# EasyEDA Pro project 电机控制板_v2.1.epro, schematic schematic11

## Sheets
1 MCU: Create Date: 2024-05-30; Page Name: MCU; Project Name: underwaterJointControlBoard_0430; Schematic Name: schematic11; Update Date: 2024-05-30; Company: 嘉立创EDA; Page Size: A4; Version: V1.0
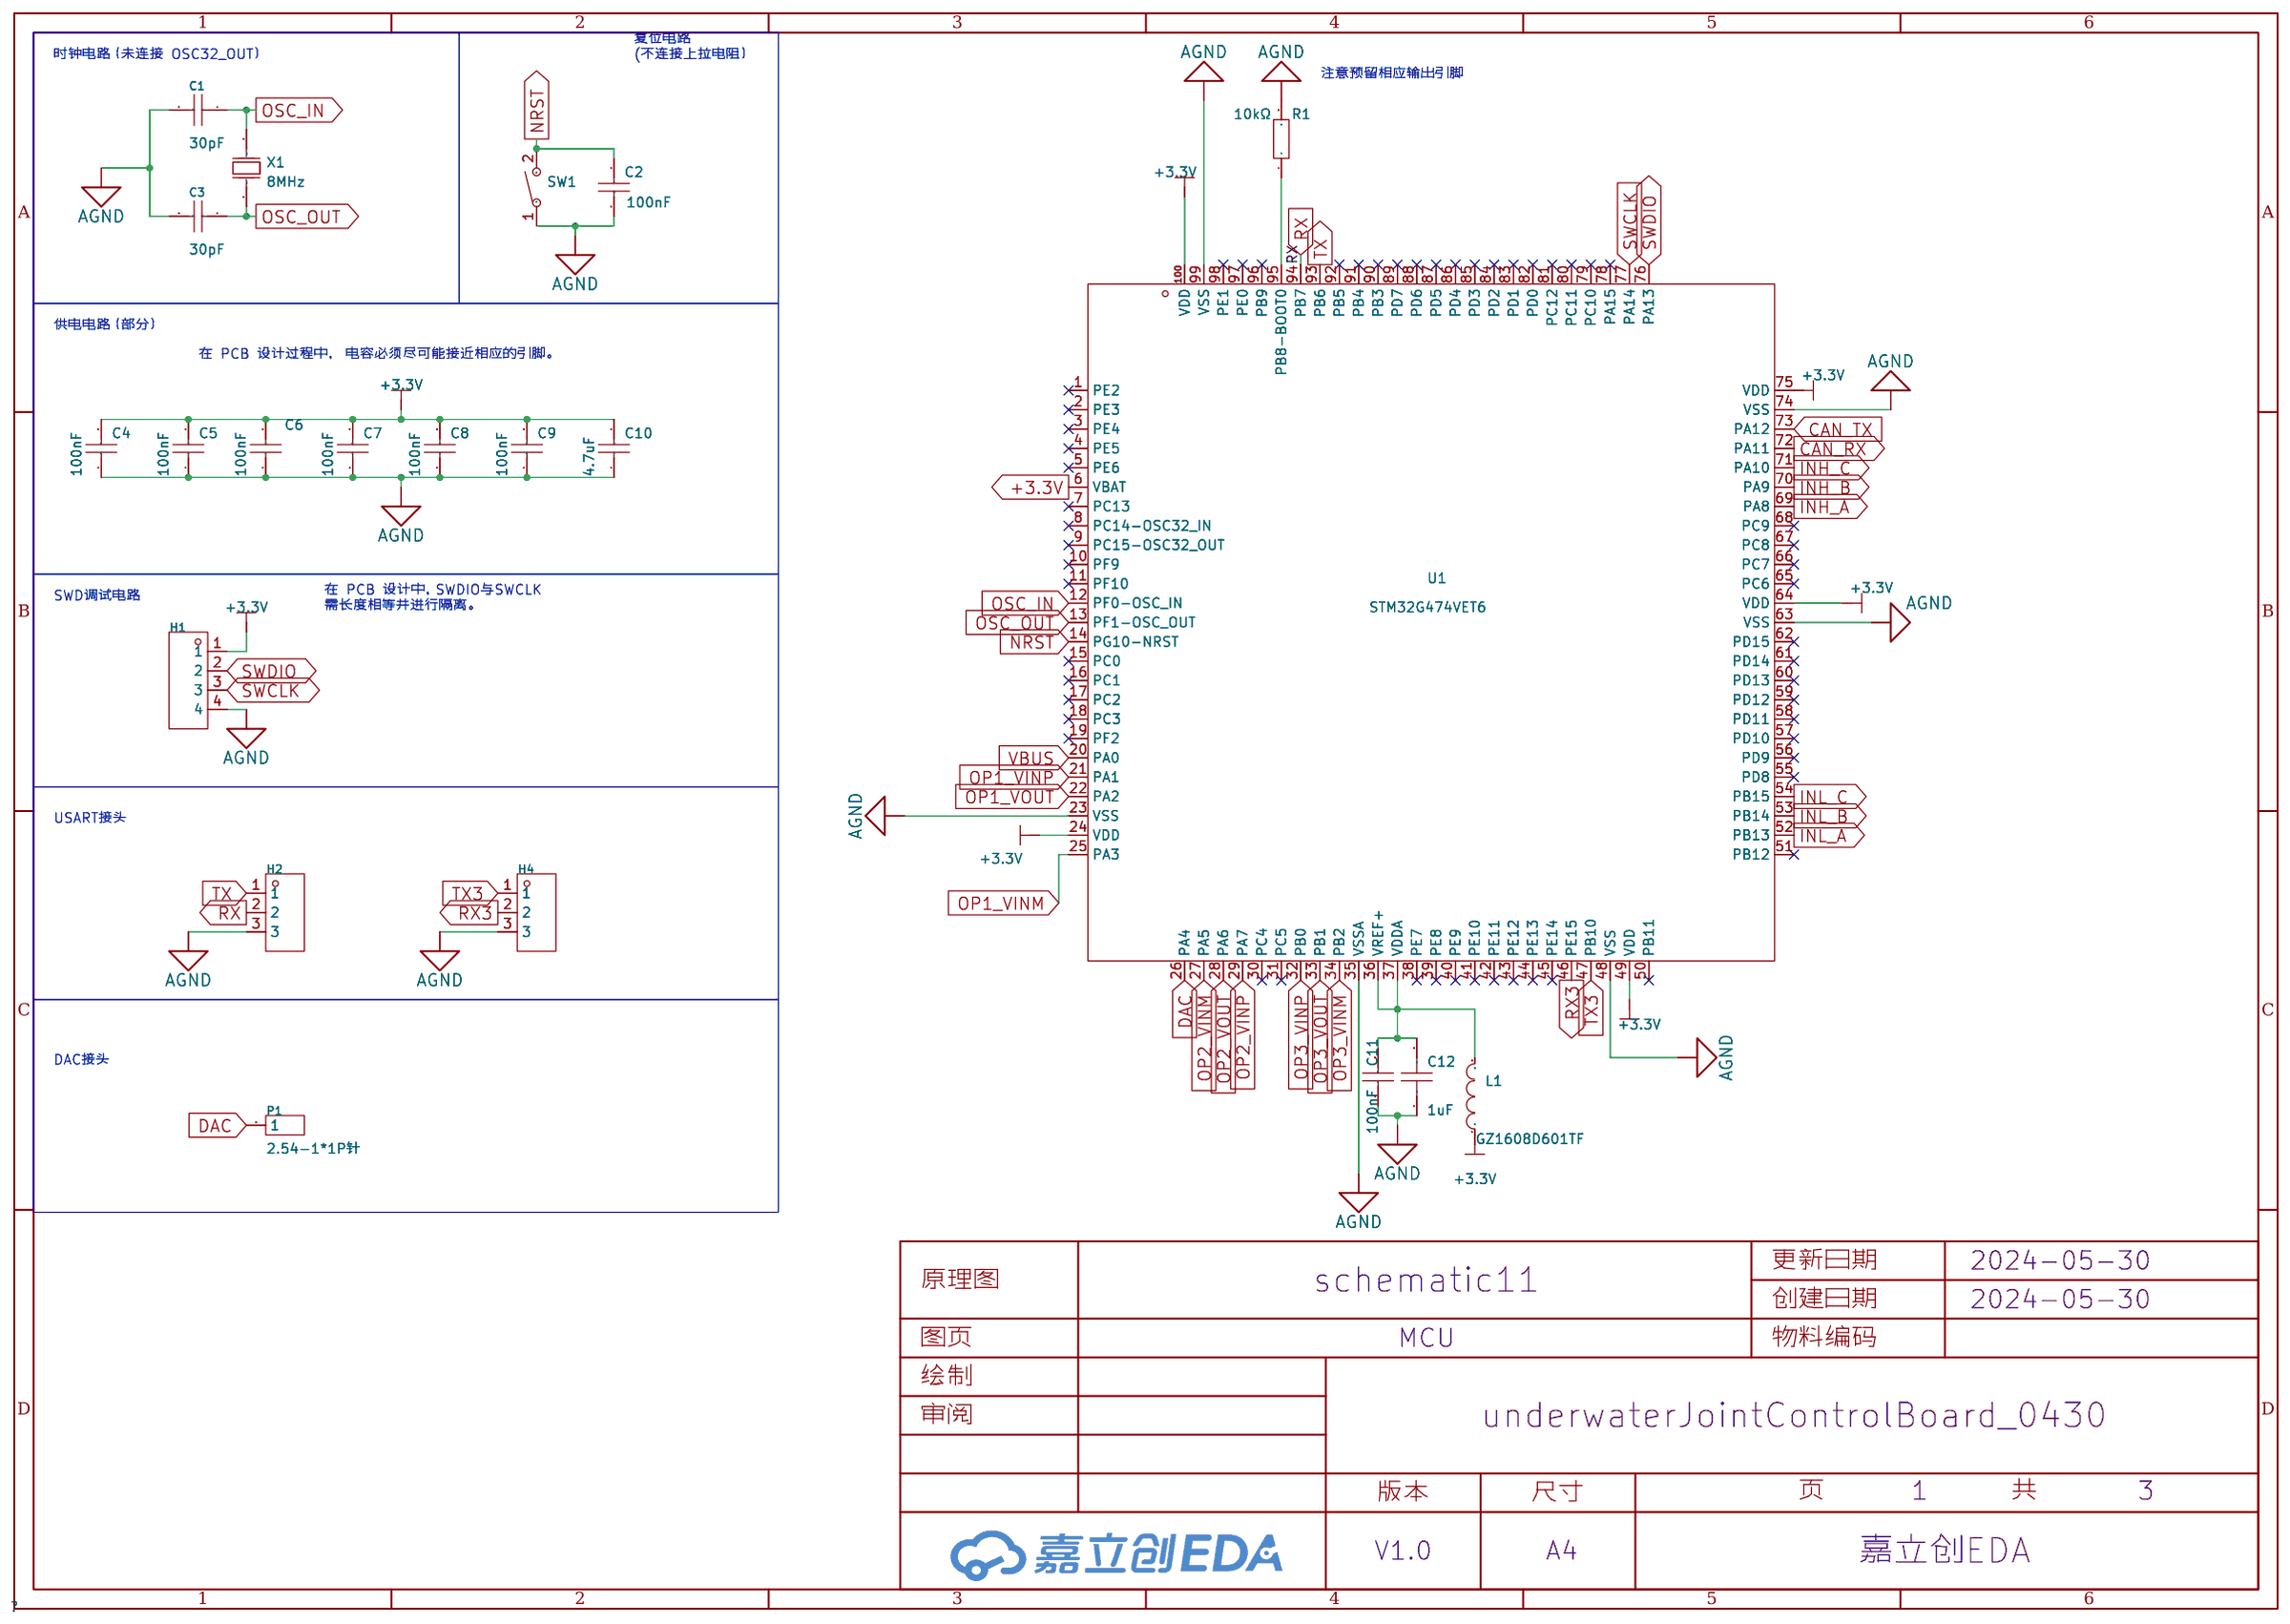
[diagram p0: MCU]
2 Power: Page Name: Power; Page Size: A3
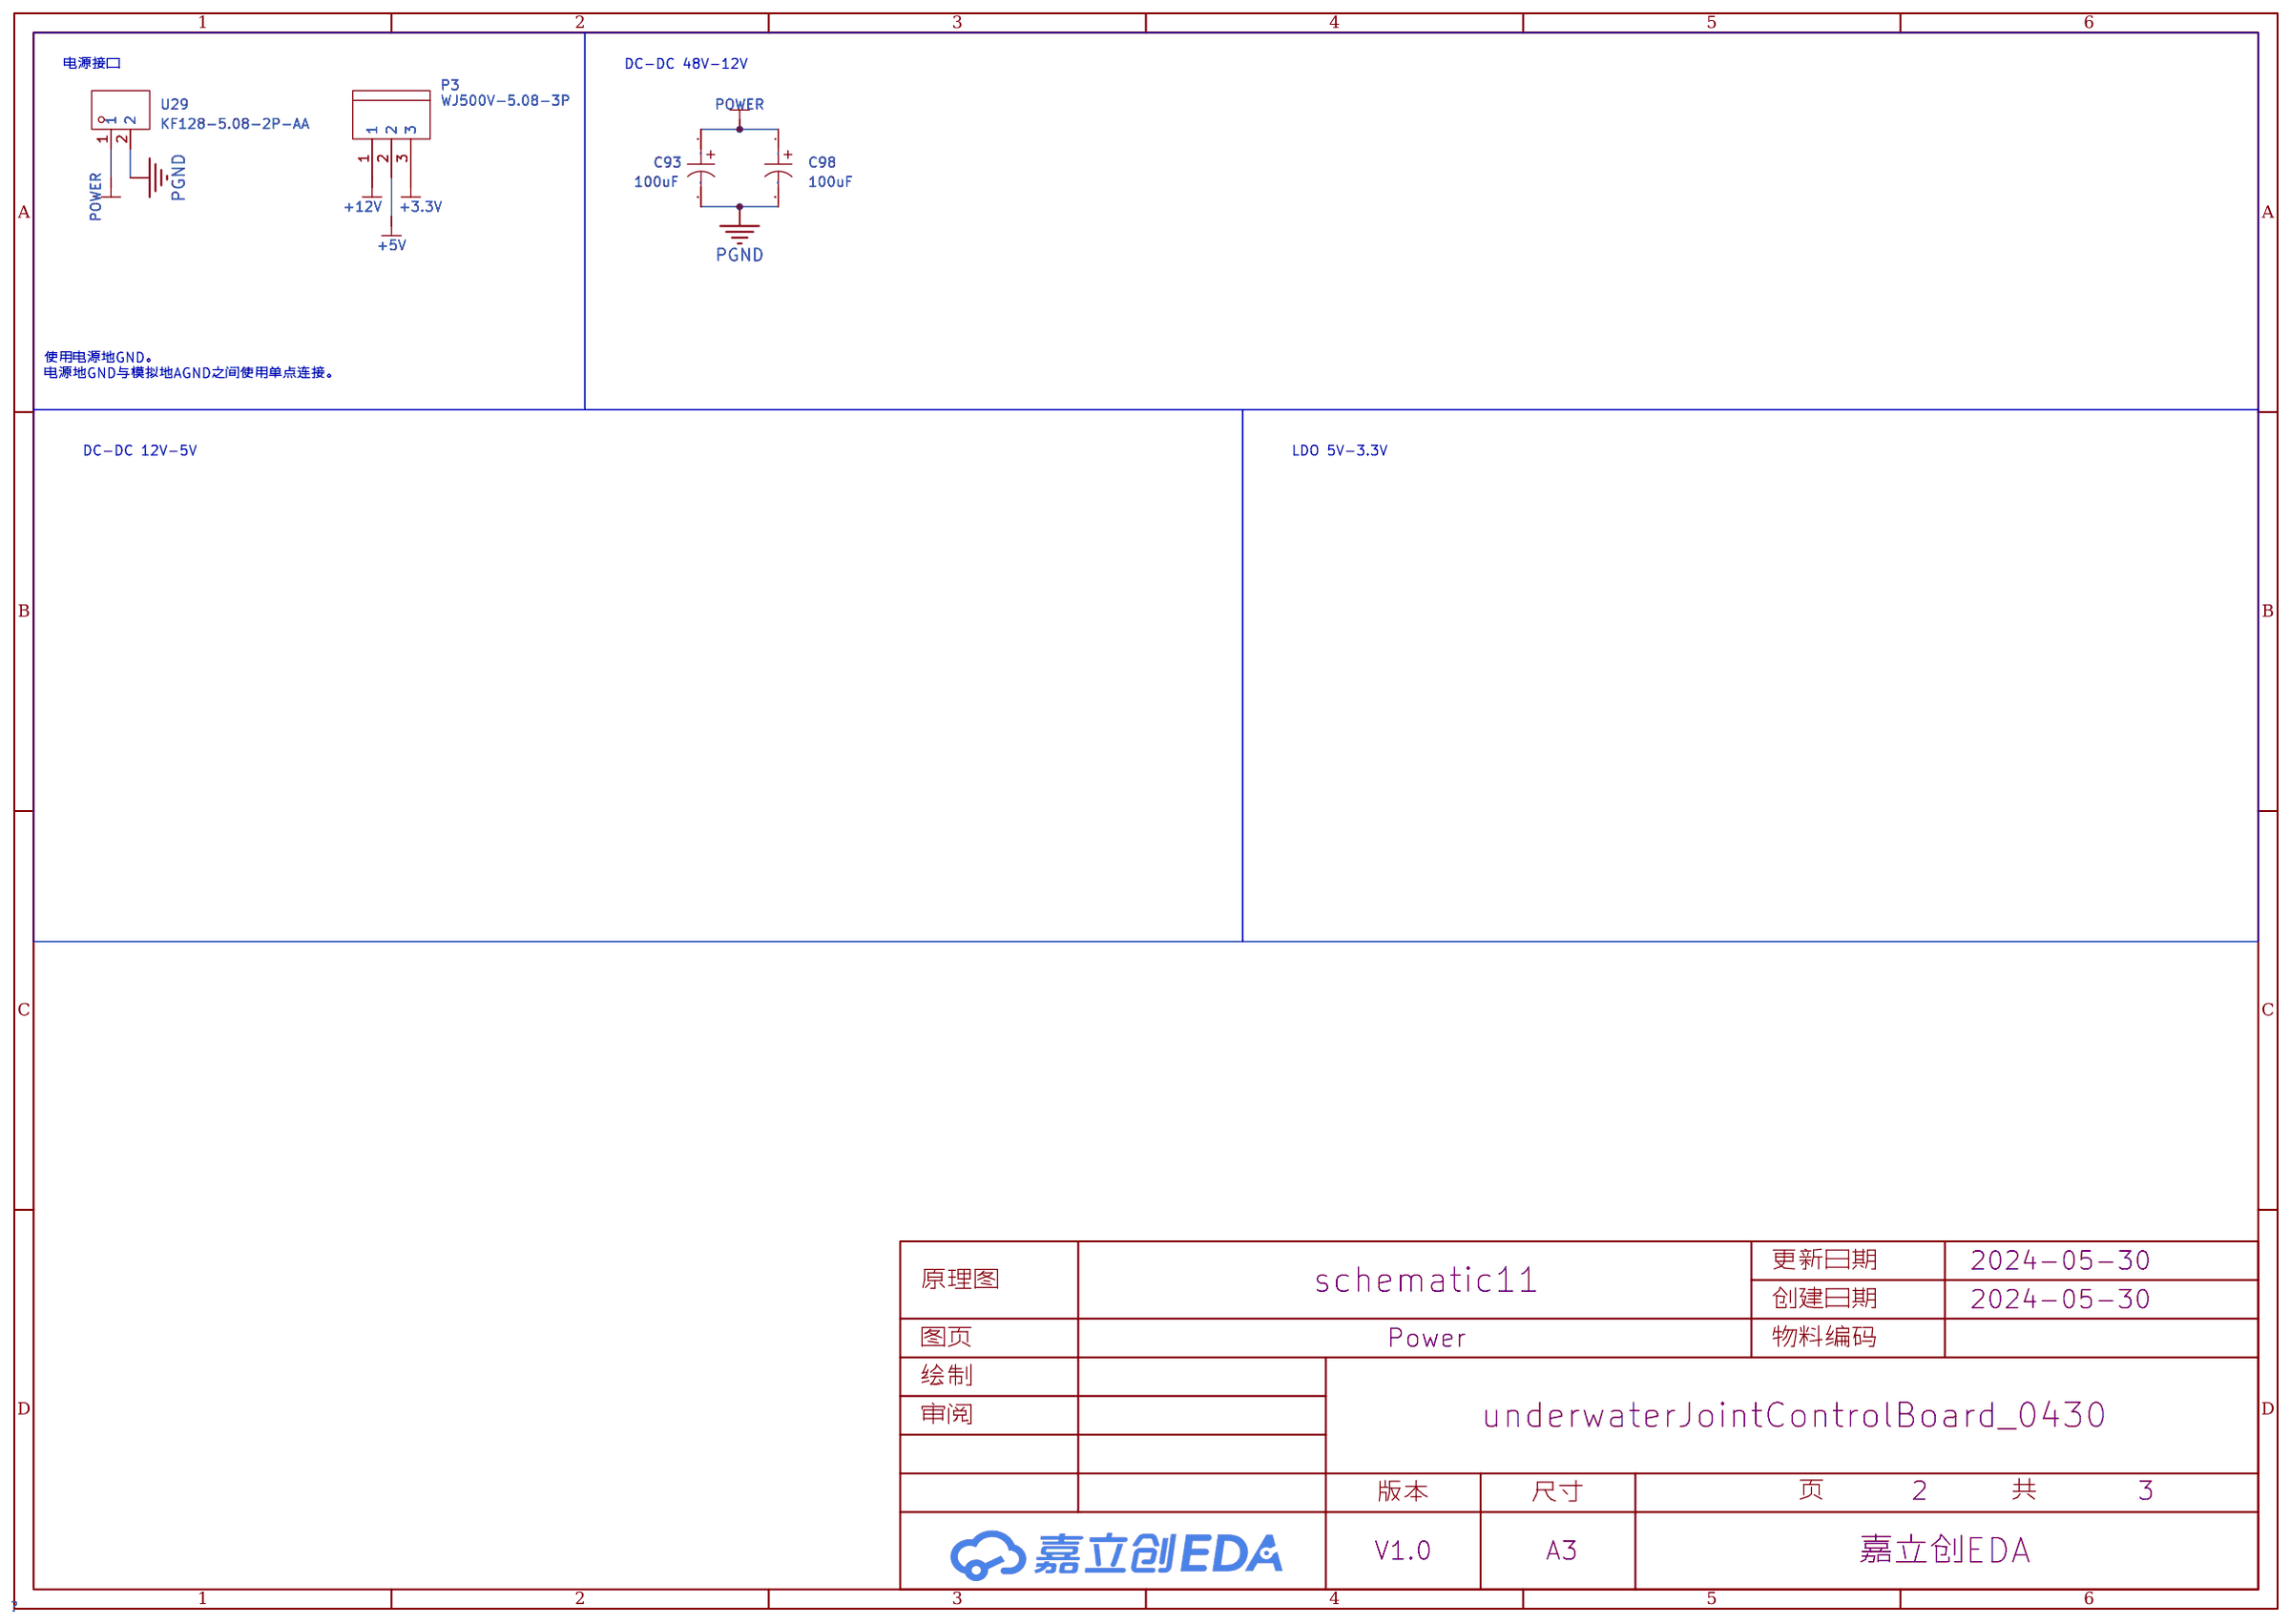
[diagram p1: Power]
3 Driver: Page Name: Driver; Page Size: A3
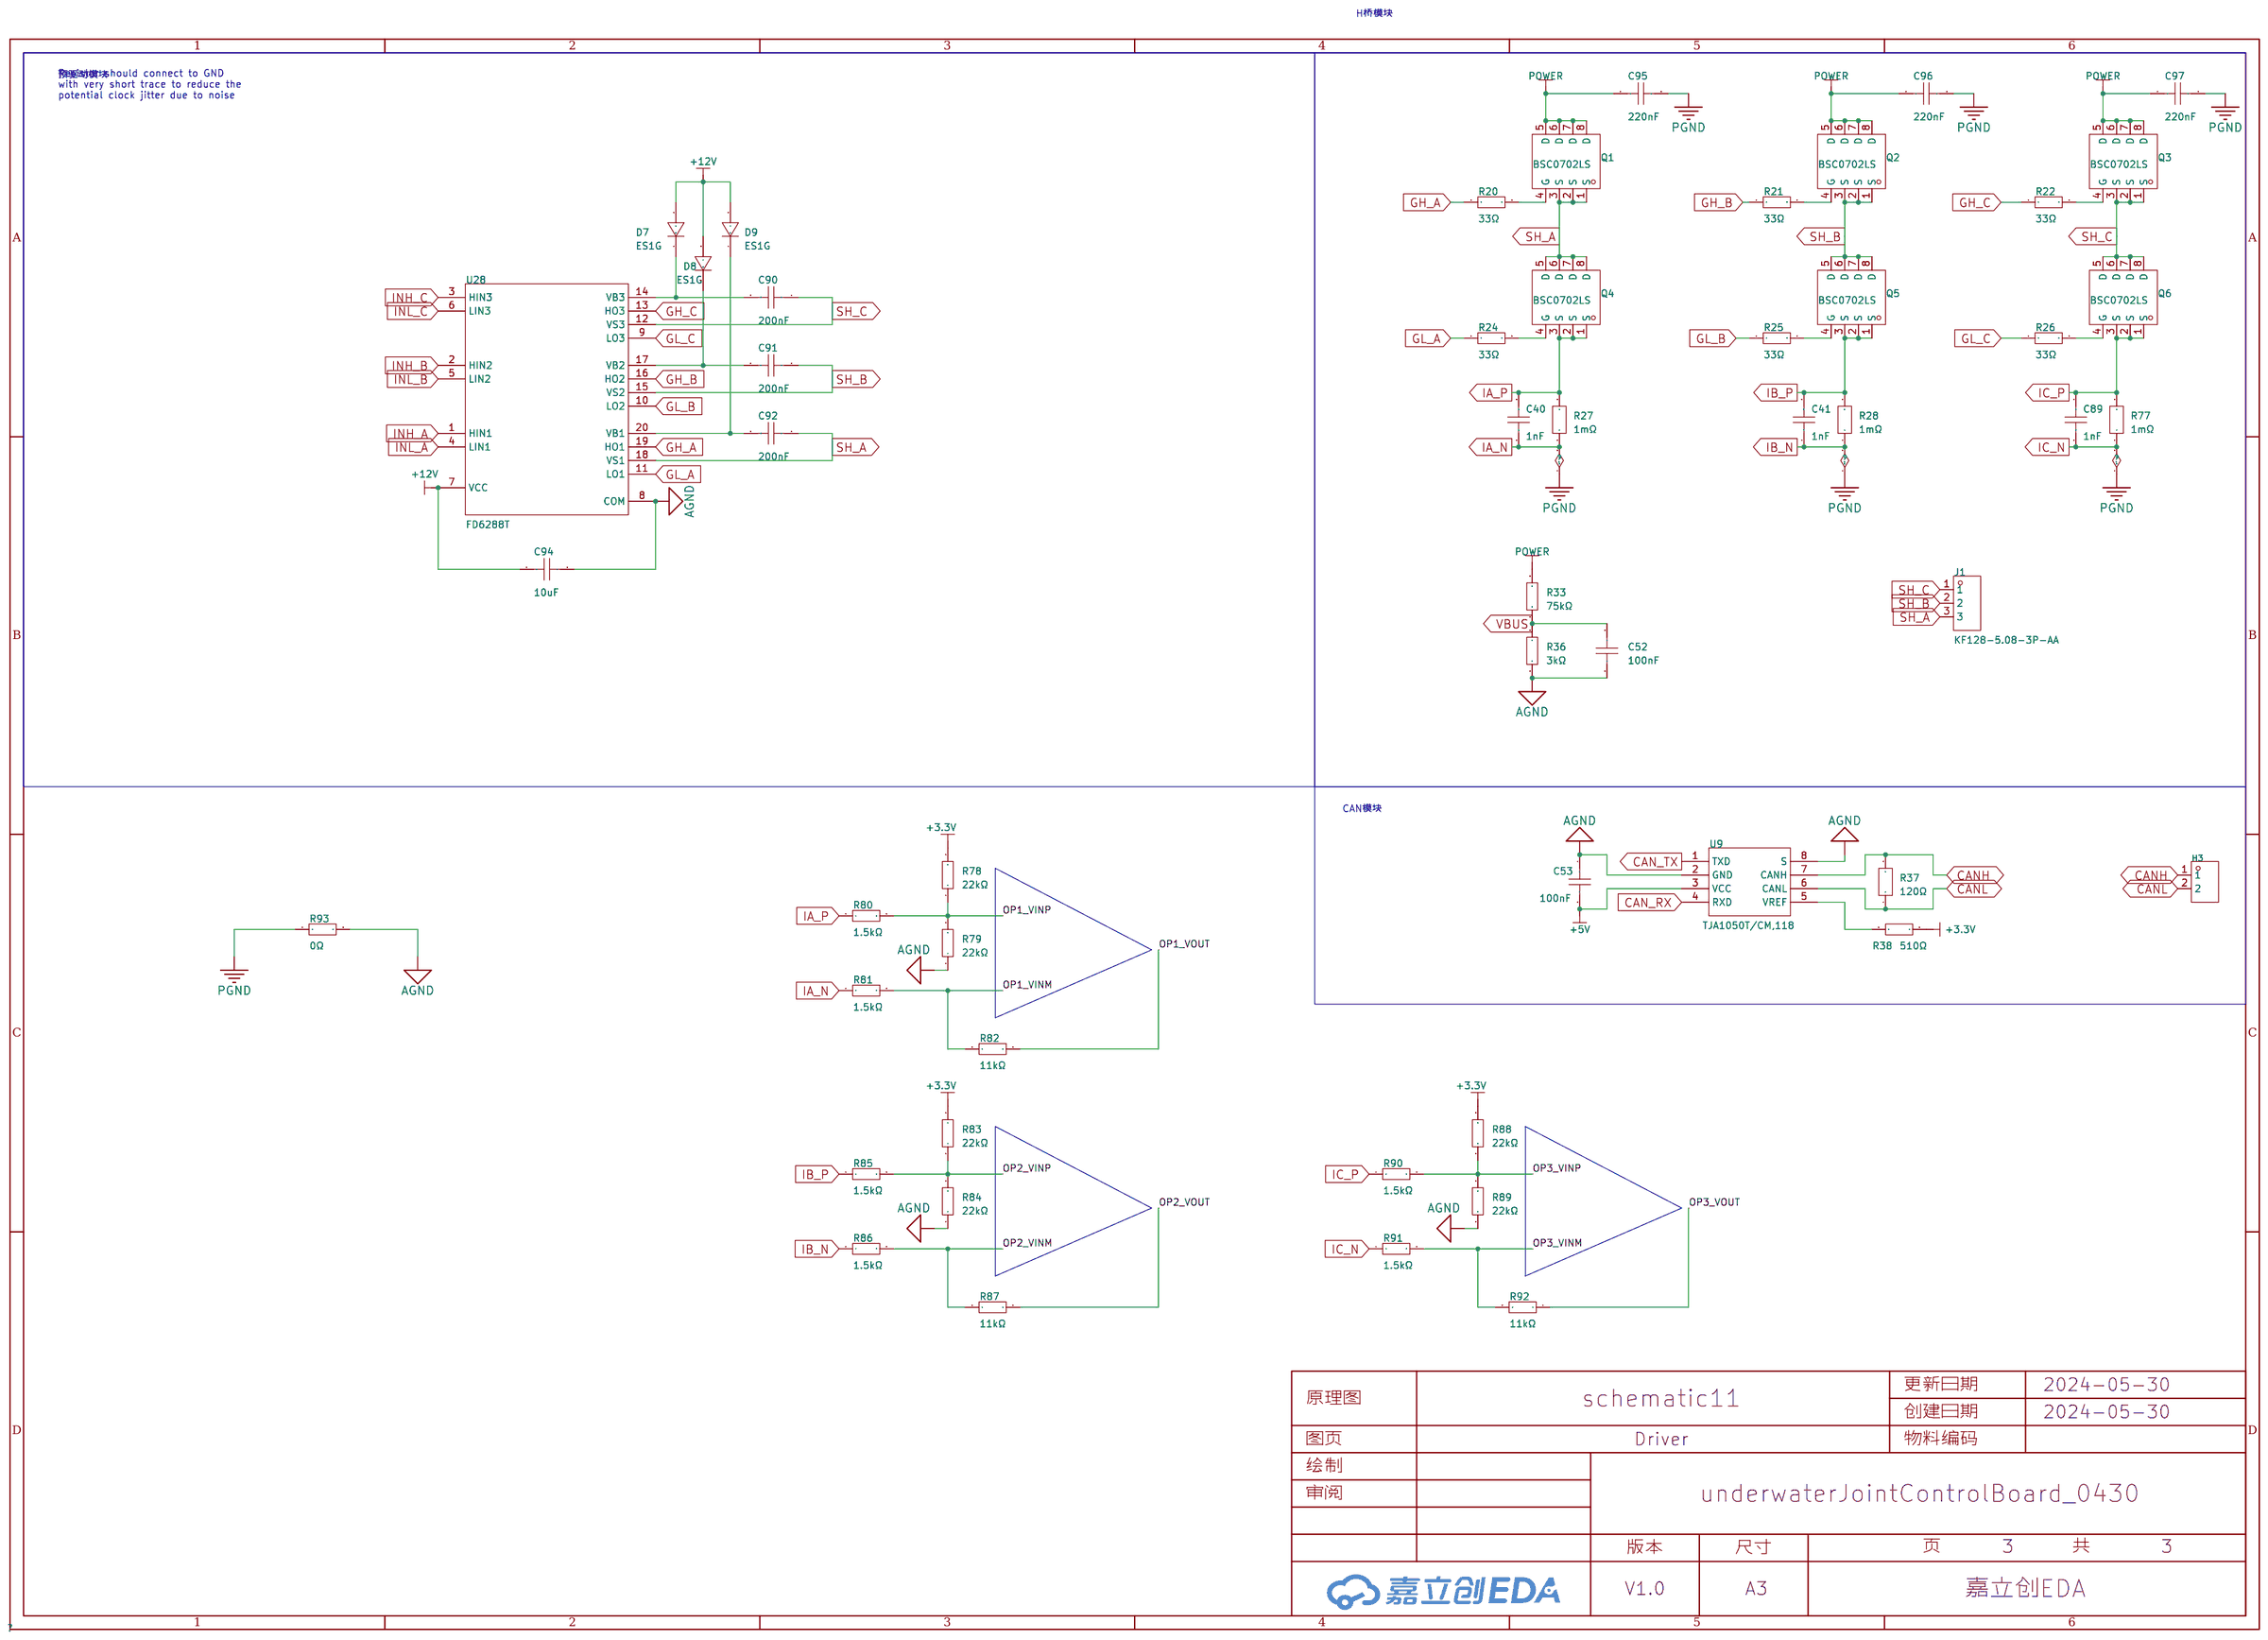
[diagram p2: Driver]

## Parts
sheet Driver
C40  1nF  [C0603]
C41  1nF  [C0603]
C52  100nF  [C0805]
C53  100nF  [C0603]
C89  1nF  [C0603]
C90  200nF  [C0805]
C91  200nF  [C0805]
C92  200nF  [C0805]
C94  10uF  [C0805]
C95  220nF  [C0805]
C96  220nF  [C0805]
C97  220nF  [C0805]
D7  ES1G  [SMA_L4.3-W2.6-LS5.2-RD]
D8  ES1G  [SMA_L4.3-W2.6-LS5.2-RD]
D9  ES1G  [SMA_L4.3-W2.6-LS5.2-RD]
H3  PZ254V-11-02P  [HDR-TH_2P-P2.54-V-M]
J1  KF128-5.08-3P-AA  [CONN-TH_3P-P5.08_KF128-5.08-3P]
Q1  BSC0702LS  [PG-TDSON-8_L5.0-W6.0-P1.27-BL-EP]
Q2  BSC0702LS  [PG-TDSON-8_L5.0-W6.0-P1.27-BL-EP]
Q3  BSC0702LS  [PG-TDSON-8_L5.0-W6.0-P1.27-BL-EP]
Q4  BSC0702LS  [PG-TDSON-8_L5.0-W6.0-P1.27-BL-EP]
Q5  BSC0702LS  [PG-TDSON-8_L5.0-W6.0-P1.27-BL-EP]
Q6  BSC0702LS  [PG-TDSON-8_L5.0-W6.0-P1.27-BL-EP]
R20  33Ω  [R0603]
R21  33Ω  [R0603]
R22  33Ω  [R0603]
R24  33Ω  [R0603]
R25  33Ω  [R0603]
R26  33Ω  [R0603]
R27  1mΩ  [RES-SMD_L6.4-W3.4]
R28  1mΩ  [RES-SMD_L6.4-W3.4]
R33  75kΩ  [R0603]
R36  3kΩ  [R0603]
R37  120Ω  [R0603]
R38  510Ω  [R0402]
R77  1mΩ  [RES-SMD_L6.4-W3.4]
R78  22kΩ  [R0603]
R79  22kΩ  [R0603]
R80  1.5kΩ  [R0603]
R81  1.5kΩ  [R0603]
R82  11kΩ  [R0603]
R83  22kΩ  [R0603]
R84  22kΩ  [R0603]
R85  1.5kΩ  [R0603]
R86  1.5kΩ  [R0603]
R87  11kΩ  [R0603]
R88  22kΩ  [R0603]
R89  22kΩ  [R0603]
R90  1.5kΩ  [R0603]
R91  1.5kΩ  [R0603]
R92  11kΩ  [R0603]
R93  0Ω  [R0603]
U9  TJA1050T/CM,118  [SOIC-8_L5.0-W4.0-P1.27-LS6.0-BL]
U28  FD6288T  [TSSOP-20_L6.5-W4.4-P0.65-LS6.4-BL]
sheet MCU
C1  30pF  [C0402]
C2  100nF  [C0402]
C3  30pF  [C0402]
C4  100nF  [C0402]
C5  100nF  [C0402]
C6  100nF  [C0402]
C7  100nF  [C0402]
C8  100nF  [C0402]
C9  100nF  [C0402]
C10  4.7uF  [C0402]
C11  100nF  [C0402]
C12  1uF  [C0402]
H1  PZ254V-11-04P  [HDR-TH_4P-P2.54-V-M]
H2  PZ254V-11-03P  [HDR-TH_3P-P2.54-V-M]
H4  PZ254V-11-03P  [HDR-TH_3P-P2.54-V-M]
L1  GZ1608D601TF  [L0603]
P1  2.54-1*1P针  [HDR-TH_1P-P2.54-V-M]
R1  10kΩ  [R0402]
SW1  TS-1185-B-B-B-A  [SW-SMD_L4.0-W3.0-LS5.0]
U1  STM32G474VET6  [LQFP-100_L14.0-W14.0-P0.50-LS16.0-BL]
X1  8MHz  [CRYSTAL-SMD_L5.0-W3.2]
sheet Power
C93  100uF  [CAP-TH_BD10.0-P5.00-D0.6-FD]
C98  100uF  [CAP-TH_BD10.0-P5.00-D0.6-FD]
P3  WJ500V-5.08-3P  [CONN-TH_3P-P5.00_WJ500V-5.08-3P]
U29  KF128-5.08-2P-AA  [CONN-TH_P5.08_KF128-5.08-2P]

## Library data of the parts
C40 C41 C89 = AC0603JRNPO9BN102: 容值:1nF;精度:±5%;额定电压:50V;材质(温度系数):NP0;; LCSC Part Name: 1nF ±5% 50V; Supplier Part: C149612; Manufacturer: YAGEO(国巨); Supplier Footprint: 0603; JLCPCB Part Class: 扩展库; Datasheet: https://atta.szlcsc.com/upload/public/pdf/source/20180316/9D9A75E34880C143C4654A71BC744002.pdf; Supplier: LCSC; Tolerance: ±5%; Voltage Rated: 50V; Temperature Coefficient: NP0; Check: true
C52 = 0805B104K101NT: 容值:100nF;精度:±10%;额定电压:100V;材质(温度系数):X7R;; LCSC Part Name: 100nF ±10% 100V; Supplier Part: C89258; Manufacturer: FH(风华); Supplier Footprint: 0805; JLCPCB Part Class: 扩展库; Datasheet: https://atta.szlcsc.com/upload/public/pdf/source/20200305/C486355_26A10D38EF8C2A5C37091D0039909270.pdf; Supplier: LCSC; Tolerance: ±10%; Voltage Rated: 100V; Temperature Coefficient: X7R; Check: true
C53 = CC0603KRX7R9BB104: 容值:100nF;精度:±10%;额定电压:50V;材质(温度系数):X7R;; LCSC Part Name: 100nF ±10% 50V; Supplier Part: C14663; Manufacturer: YAGEO(国巨); Supplier Footprint: 0603; JLCPCB Part Class: 基础库; Datasheet: https://atta.szlcsc.com/upload/public/pdf/source/20180910/C282072_33301C7F631E79921B82A8DAC6BCC5B3.pdf; Supplier: LCSC; Tolerance: ±10%; Voltage Rated: 50V; Temperature Coefficient: X7R; Check: true
C90-C92 = TCC0805X7R204K500DT: 容值:200nF;精度:±10%;额定电压:50V;材质(温度系数):X7R;; LCSC Part Name: 200nF ±10% 50V; Supplier Part: C344170; Manufacturer: CCTC(三环); Supplier Footprint: 0805; JLCPCB Part Class: 扩展库; Datasheet: https://atta.szlcsc.com/upload/public/pdf/source/20191203/C466239_F62A586702D44EEA1C39B32FC8662B21.pdf; Supplier: LCSC; Tolerance: ±10%; Voltage Rated: 50V; Temperature Coefficient: X7R; Check: true
C94 = GRM21BR61H106KE43L: 容值:10uF;精度:±10%;额定电压:50V;材质(温度系数):X5R;; LCSC Part Name: 10uF±10%50V; Supplier Part: C440198; Manufacturer: muRata(村田); Supplier Footprint: 0805; JLCPCB Part Class: BasicPart; Datasheet: https://atta.szlcsc.com/upload/public/pdf/source/20191220/C440198_2DEA1B9834E321C8893F7972E9DFE5B0.pdf; Supplier: LCSC; Tolerance: ±10%; Voltage Rated: 50V; Temperature Coefficient: X5R; Check: true
C95-C97 = CC0805KKX7R0BB224: 容值:220nF;精度:±10%;额定电压:100V;材质(温度系数):X7R;; LCSC Part Name: 220nF ±10% 100V; Supplier Part: C513710; Manufacturer: YAGEO(国巨); Supplier Footprint: 0805; JLCPCB Part Class: 扩展库; Datasheet: https://atta.szlcsc.com/upload/public/pdf/source/20200415/C513710_E616D17FC8BD60A9433B28768FD75383.pdf; Supplier: LCSC; Tolerance: ±10%; Voltage Rated: 100V; Temperature Coefficient: X7R; Check: true
D7-D9 = ES1G_C123904: 二极管配置:独立式;正向压降(Vf):1.25V@1A;直流反向耐压(Vr):400V;平均整流电流(Io):1A;反向恢复时间(trr):35ns;; LCSC Part Name: 电压:400V 电流:1A; Supplier Part: C123904; Manufacturer: 晶导微电子; Supplier Footprint: SMA; JLCPCB Part Class: 扩展库; Datasheet: https://atta.szlcsc.com/upload/public/pdf/source/20170804/C123904_1501836215807866144.pdf; Supplier: LCSC; Diode Configuration: 独立式; Forward Voltage (Vf@If): 1.25V@1A; Reverse Voltage (Vr): 400V; Average Rectified Current (Io): 1A; Reverse Leakage Current: 5uA@400V; Reverse Recovery Time (trr): 35ns; Operating Temperature: -55℃~+150℃@(Tj); Check: true
H3 = PZ254V-11-02P: 排数:单排;总PIN位数:2P;间距:2.54mm;插针结构:1x2P;行距:-;安装类型:直插;圆针/方针:方针;额定电流:-;额定电压:-;配合针长度:6mm;塑高:2.5mm;端接针长度:3mm;触头材质:黄铜;触头镀层:-;工作温度范围:-40℃~+105℃;颜色:黑色;; LCSC Part Name: 2.54mm 1x2P 直插 方针; Supplier Part: C492401; Manufacturer: XFCN(兴飞); Supplier Footprint: 插件,P=2.54mm; JLCPCB Part Class: 扩展库; Datasheet: https://atta.szlcsc.com/upload/public/pdf/source/20200309/C492401_A812433581A9B211A7FFA413ADDFF0E5.pdf; Supplier: LCSC; Number of Rows: 单排; Number of Pins: 2P; Pitch: 2.54mm; Pin Structure: 1x2P; Mounting Type: 直插; Circluar Pins/Square Pins: 方针; Length of Mating Pin: 6mm; Insulation Height: 2.5mm; Length of End Connection Pin: 3mm; Contact Material: 黄铜; Operating Temperature Range: -40℃~+105℃; Color: 黑色; Check: true
J1 = KF128-5.08-3P-AA: 间距:5.08mm;结构:1x3P;排数:1;每排PIN数:3;安装方式:直插;额定电流:24A;额定电压:250V;线规 - AWG:12~22;线规 - mm2:2.5;工作温度范围:-40℃~+105℃;颜色:绿色;; LCSC Part Name: 5.08mm 1x3P 排数:1 每排P数:3 直插 可拼接 铜 环保; Supplier Part: C474953; Manufacturer: KEFA(科发); Supplier Footprint: 插件,P=5.08mm; JLCPCB Part Class: 扩展库; Datasheet: https://atta.szlcsc.com/upload/public/pdf/source/20230317/DADFED05827EAD48C1D5B8C3D4CF88F4.pdf; Supplier: LCSC; Pitch: 5.08mm; Structure: 1x3P; Number of Rows: 1; Number of PINs Per Row: 3; Mounting Style: 直插; Current Rating (Max): 24A; Voltage Rating (Max): 250V; Wire Gauge - AWG: 12~22; Wire Gauge - mm2: 2.5; Operating Temperature Range: -40℃~+105℃; Color: 绿色; Number of Pins: 3P; Check: true
Q1-Q6 = BSC0702LS: 类型:N沟道;漏源电压(Vdss):60V;连续漏极电流(Id):100A;功率(Pd):83W;导通电阻(RDS(on)@Vgs,Id):2.3mΩ@10V,50A;; LCSC Part Name: N沟道 耐压:60V 电流:100A; Supplier Part: C501503; Manufacturer: Infineon(英飞凌); Supplier Footprint: TDSON-8-EP(5x6); JLCPCB Part Class: 扩展库; Datasheet: https://atta.szlcsc.com/upload/public/pdf/source/20200324/C501503_BE3C55BAEEDCAD77F3934BFEE5415F86.pdf; Supplier: LCSC; Type: N沟道; Drain Source Voltage (Vdss): 60V; Continuous Drain Current (Id): 100A; Power Dissipation (Pd): 83W; Drain Source On Resistance (RDS(on)@Vgs,Id): 2.3mΩ@10V,50A; Gate Threshold Voltage (Vgs(th)@Id): 2.3V@49uA; Check: true
R20-R22 R24-R26 = 0603WAF330JT5E: 阻值:33Ω;精度:±1%;功率:100mW;温度系数:±100ppm/℃;电阻类型:厚膜电阻;; LCSC Part Name: 33Ω ±1% 100mW 厚膜电阻; Supplier Part: C23140; Manufacturer: UNI-ROYAL(厚声); Supplier Footprint: 0603; JLCPCB Part Class: 基础库; Datasheet: https://atta.szlcsc.com/upload/public/pdf/source/20200306/C422600_1E6D84923E4A46A82E41ADD87F860B5C.pdf; Supplier: LCSC; Tolerance: ±1%; Power(Watts): 100mW; Overload Voltage (Max): 75V; Temperature Coefficient: ±100ppm/℃; Type: 厚膜电阻; Operating Temperature Range: -55℃~+155℃; Check: true
R27 R28 R77 = EBWM2512F1L00S9: 电阻类型:采样电阻;阻值:1mΩ;精度:±1%;功率:6W;温度系数:±200ppm/℃;安装方式:贴片;; LCSC Part Name: 1mΩ ±1% 6W; Supplier Part: C5224158; Manufacturer: RESI(开步睿思); Supplier Footprint: 2512; JLCPCB Part Class: Extended Part; Datasheet: https://atta.szlcsc.com/upload/public/pdf/source/20231123/32E1A2B1C6B1C8175FF8915A40EC1366.pdf; Supplier: LCSC; Tolerance: ±1%; Power(Watts): 6W; Temperature Coefficient: ±200ppm/℃; Type: 采样电阻; Mounting Sytle: 贴片; Check: true
R33 = 0603WAF7502T5E: 阻值:75kΩ;精度:±1%;功率:100mW;温度系数:±100ppm/℃;电阻类型:厚膜电阻;; LCSC Part Name: 75kΩ ±1% 100mW 厚膜电阻; Supplier Part: C23242; Manufacturer: UNI-ROYAL(厚声); Supplier Footprint: 0603; JLCPCB Part Class: 基础库; Datasheet: https://atta.szlcsc.com/upload/public/pdf/source/20200306/C422600_1E6D84923E4A46A82E41ADD87F860B5C.pdf; Supplier: LCSC; Tolerance: ±1%; Power(Watts): 100mW; Overload Voltage (Max): 75V; Temperature Coefficient: ±100ppm/℃; Type: 厚膜电阻; Operating Temperature Range: -55℃~+155℃; Check: true
R36 = 0603WAF3001T5E: 阻值:3kΩ;精度:±1%;功率:100mW;温度系数:±100ppm/℃;电阻类型:厚膜电阻;; LCSC Part Name: 3kΩ ±1% 100mW 厚膜电阻; Supplier Part: C4211; Manufacturer: UNI-ROYAL(厚声); Supplier Footprint: 0603; JLCPCB Part Class: 基础库; Datasheet: https://atta.szlcsc.com/upload/public/pdf/source/20200306/C422600_1E6D84923E4A46A82E41ADD87F860B5C.pdf; Supplier: LCSC; Tolerance: ±1%; Power(Watts): 100mW; Overload Voltage (Max): 75V; Temperature Coefficient: ±100ppm/℃; Type: 厚膜电阻; Operating Temperature Range: -55℃~+155℃; Check: true
R37 = ERJPA3J121V: 阻值:120Ω;精度:±5%;功率:250mW;温度系数:±200ppm/℃;电阻类型:厚膜电阻;; LCSC Part Name: 120Ω ±5% 250mW 厚膜电阻; Supplier Part: C445808; Manufacturer: PANASONIC(松下); Supplier Footprint: 0603; JLCPCB Part Class: 扩展库; Datasheet: https://atta.szlcsc.com/upload/public/pdf/source/20191108/C445866_CA3143DB612218EAD038C79F733E1EE0.pdf; Supplier: LCSC; Tolerance: ±5%; Power(Watts): 250mW; Temperature Coefficient: ±200ppm/℃; Type: 厚膜电阻; Operating Temperature Range: -55℃~+155℃; Check: true
R38 = 0402WGF5100TCE: 阻值:510Ω;精度:±1%;功率:62.5mW;温度系数:±100ppm/℃;电阻类型:厚膜电阻;; LCSC Part Name: 510Ω ±1% 62.5mW 厚膜电阻; Supplier Part: C25123; Manufacturer: UNI-ROYAL(厚声); Supplier Footprint: 0402; JLCPCB Part Class: 基础库; Datasheet: https://atta.szlcsc.com/upload/public/pdf/source/20200306/C422600_1E6D84923E4A46A82E41ADD87F860B5C.pdf; Supplier: LCSC; Tolerance: ±1%; Power(Watts): 62.5mW; Overload Voltage (Max): 50V; Temperature Coefficient: ±100ppm/℃; Type: 厚膜电阻; Operating Temperature Range: -55℃~+155℃; Check: true
R78 R79 R83 R84 R88 R89 = 0603WAF2202T5E: 电阻类型:厚膜电阻;阻值:22kΩ;精度:±1%;功率:100mW;最大工作电压:75V;温度系数:±100ppm/℃;; LCSC Part Name: 22kΩ ±1% 100mW 厚膜电阻; Supplier Part: C31850; Manufacturer: UNI-ROYAL(厚声); Supplier Footprint: 0603; JLCPCB Part Class: 基础库; Datasheet: https://atta.szlcsc.com/upload/public/pdf/source/20200306/C422600_1E6D84923E4A46A82E41ADD87F860B5C.pdf; Supplier: LCSC; Type: 厚膜电阻; Tolerance: ±1%; Power(Watts): 100mW; Overload Voltage (Max): 75V; Temperature Coefficient: ±100ppm/℃; Operating Temperature Range: -55℃~+155℃; Check: true
R80 R81 R85 R86 R90 R91 = 0603WAF1501T5E: 电阻类型:厚膜电阻;阻值:1.5kΩ;精度:±1%;功率:100mW;最大工作电压:75V;温度系数:±100ppm/℃;; LCSC Part Name: 1.5kΩ ±1% 100mW 厚膜电阻; Supplier Part: C22843; Manufacturer: UNI-ROYAL(厚声); Supplier Footprint: 0603; JLCPCB Part Class: 基础库; Datasheet: https://atta.szlcsc.com/upload/public/pdf/source/20200306/C422600_1E6D84923E4A46A82E41ADD87F860B5C.pdf; Supplier: LCSC; Type: 厚膜电阻; Tolerance: ±1%; Power(Watts): 100mW; Overload Voltage (Max): 75V; Temperature Coefficient: ±100ppm/℃; Operating Temperature Range: -55℃~+155℃; Check: true
R82 R87 R92 = 0603WAF1102T5E: 电阻类型:厚膜电阻;阻值:11kΩ;精度:±1%;功率:100mW;最大工作电压:75V;温度系数:±100ppm/℃;; LCSC Part Name: 11kΩ ±1% 100mW 厚膜电阻; Supplier Part: C25950; Manufacturer: UNI-ROYAL(厚声); Supplier Footprint: 0603; JLCPCB Part Class: 扩展库; Datasheet: https://atta.szlcsc.com/upload/public/pdf/source/20200306/C422600_1E6D84923E4A46A82E41ADD87F860B5C.pdf; Supplier: LCSC; Type: 厚膜电阻; Tolerance: ±1%; Power(Watts): 100mW; Overload Voltage (Max): 75V; Temperature Coefficient: ±100ppm/℃; Operating Temperature Range: -55℃~+155℃; Check: true
R93 = 0603WAF0000T5E: 阻值:0Ω;精度:±1%;功率:100mW;电阻类型:厚膜电阻;; LCSC Part Name: 0Ω ±1% 100mW 厚膜电阻; Supplier Part: C21189; Manufacturer: UNI-ROYAL(厚声); Supplier Footprint: 0603; JLCPCB Part Class: 基础库; Datasheet: https://atta.szlcsc.com/upload/public/pdf/source/20200306/C422600_1E6D84923E4A46A82E41ADD87F860B5C.pdf; Supplier: LCSC; Tolerance: ±1%; Power(Watts): 100mW; Overload Voltage (Max): 75V; Type: 厚膜电阻; Operating Temperature Range: -55℃~+155℃; Check: true
U9 = TJA1050T/CM,118: 类型:收发器;; LCSC Part Name: 4.75V~5.25V; Supplier Part: C6952; Manufacturer: NXP(恩智浦); Supplier Footprint: SOIC-8; JLCPCB Part Class: 扩展库; Datasheet: https://atta.szlcsc.com/upload/public/pdf/source/20140411/1457707042917.pdf; Supplier: LCSC; Type: 收发器; Supply Voltage: 4.75V~5.25V; Supply Current: 50mA; Check: true
U28 = FD6288T: 三个独立的半桥栅极驱动集成电路芯片; Supplier Part: C97683; Manufacturer: Fortior Tech(峰岹); Supplier Footprint: TSSOP-20; JLCPCB Part Class: 扩展库; Datasheet: https://atta.szlcsc.com/upload/public/pdf/source/20180912/C97683_ECE58C9DF7F061C95E95DF4276B152DC.pdf; Supplier: LCSC; Check: true
C1 C3 = 0402CG300J500NT: 容值:30pF;精度:±5%;额定电压:50V;材质(温度系数):C0G;; LCSC Part Name: 30pF ±5% 50V; Supplier Part: C1570; Manufacturer: FH(风华); Supplier Footprint: 0402; JLCPCB Part Class: 扩展库; Supplier: LCSC; Tolerance: ±5%; Voltage Rated: 50V; Temperature Coefficient: C0G; Check: true
C2 C4-C9 C11 = CL05B104KO5NNNC: 容值:100nF;精度:±10%;额定电压:16V;材质(温度系数):X7R;; LCSC Part Name: 100nF ±10% 16V; Supplier Part: C1525; Manufacturer: SAMSUNG(三星); Supplier Footprint: 0402; JLCPCB Part Class: 基础库; Datasheet: https://atta.szlcsc.com/upload/public/pdf/source/20160218/1457707763339.pdf; Supplier: LCSC; Tolerance: ±10%; Voltage Rated: 16V; Temperature Coefficient: X7R; Check: true
C10 = CL05A475MP5NRNC: 容值:4.7uF;精度:±20%;额定电压:10V;材质(温度系数):X5R;; LCSC Part Name: 4.7uF ±20% 10V; Supplier Part: C23733; Manufacturer: SAMSUNG(三星); Supplier Footprint: 0402; JLCPCB Part Class: 基础库; Datasheet: https://atta.szlcsc.com/upload/public/pdf/source/20160103/1457707710457.pdf; Supplier: LCSC; Tolerance: ±20%; Voltage Rated: 10V; Temperature Coefficient: X5R; Check: true
C12 = CL05A105KA5NQNC: 容值:1uF;精度:±10%;额定电压:25V;材质(温度系数):X5R;; LCSC Part Name: 1uF ±10% 25V; Supplier Part: C52923; Manufacturer: SAMSUNG(三星); Supplier Footprint: 0402; JLCPCB Part Class: 基础库; Datasheet: https://atta.szlcsc.com/upload/public/pdf/source/20160103/1457707735223.pdf; Supplier: LCSC; Tolerance: ±10%; Voltage Rated: 25V; Temperature Coefficient: X5R; Check: true
H1 = PZ254V-11-04P: 排数:单排;总PIN位数:4P;间距:2.54mm;插针结构:1x4P;行距:-;安装类型:直插;圆针/方针:方针;额定电流:3A;额定电压:250V;配合针长度:6mm;塑高:2.5mm;端接针长度:3mm;触头材质:-;工作温度范围:-40℃~+105℃;颜色:黑色;; LCSC Part Name: 2.54mm 1x4P 直插 方针; Supplier Part: C2691448; Manufacturer: XFCN(兴飞); Supplier Footprint: 插件,P=2.54mm; JLCPCB Part Class: 扩展库; Datasheet: https://atta.szlcsc.com/upload/public/pdf/source/20200309/C492403_F9F19131791D08044AD4F84F8E751A34.pdf; Supplier: LCSC; Number of Rows: 单排; Number of Pins: 4P; Pitch: 2.54mm; Pin Structure: 1x4P; Mounting Type: 直插; Circluar Pins/Square Pins: 方针; Current Rating (Max): 3A; Voltage Rating (Max): 250V; Length of Mating Pin: 6mm; Insulation Height: 2.5mm; Length of End Connection Pin: 3mm; Operating Temperature Range: -40℃~+105℃; Color: 黑色; Check: true
H2 H4 = PZ254V-11-03P: 排数:单排;总PIN位数:3;间距:2.54mm;插针结构:1x3P;行距:-;安装类型:直插;圆针/方针:方针;额定电流:3A;额定电压:250V;配合针长度:6mm;塑高:2.5mm;端接针长度:3mm;工作温度范围:-40℃~+105℃;颜色:黑色;; LCSC Part Name: 2.54mm 1x3P 直插 方针; Supplier Part: C2937625; Manufacturer: XFCN(兴飞); Supplier Footprint: 直插,P=2.54mm; JLCPCB Part Class: 扩展库; Datasheet: 2022-07-12/581362A/62b9d00620994b3696be7eb4af85ad72/双排排针和单排排针.pdf; Supplier: LCSC; Number of Rows: 单排; Number of Pins: 3; Pitch: 2.54mm; Pin Structure: 1x3P; Mounting Type: 直插; Circluar Pins/Square Pins: 方针; Current Rating (Max): 3A; Voltage Rating (Max): 250V; Length of Mating Pin: 6mm; Insulation Height: 2.5mm; Length of End Connection Pin: 3mm; Operating Temperature Range: -40℃~+105℃; Color: 黑色; Check: true
L1 = GZ1608D601TF: 标称阻抗@测试频率:600Ω@100MHz;误差:±25%;直流电阻(RDC):450mΩ;; LCSC Part Name: 单路 0603磁珠 阻抗600Ω@100MHz; Supplier Part: C1002; Manufacturer: Sunlord(顺络); Supplier Footprint: 0603; JLCPCB Part Class: 基础库; Datasheet: https://atta.szlcsc.com/upload/public/pdf/source/20210830/355EA7C0FAC5394FC0FE3F17C770C20A.pdf; Supplier: LCSC; Impedance @ Frequency: 600Ω@100MHz; Tolerance: ±25%; DC Resistance: 450mΩ; Current Rating: 200mA; Circuits: 1; Check: true
P1 = 2.54-1*1P针: 插针结构:-;间距:-;行距:-;圆针/方针:-;安装类型:直插;排数:单排;总PIN位数:1P;额定电流:-;额定电压:-;配合针长度:-;塑高:-;触头材质:-;触头镀层:-;颜色:黑色;; LCSC Part Name: 直插; Supplier Part: C81276; Manufacturer: BOOMELE(博穆精密); Supplier Footprint: 插件,P=2.54mm; JLCPCB Part Class: 扩展库; Datasheet: https://atta.szlcsc.com/upload/public/pdf/source/20221018/3E9408392E35E6F57A28985E5F7BF5C9.pdf; Supplier: LCSC; Mounting Type: 直插; Number of Rows: 单排; Number of Pins: 1P; Color: 黑色; Check: true
R1 = 0402WGF1002TCE: 阻值:10kΩ;精度:±1%;功率:62.5mW;温度系数:±100ppm/℃;电阻类型:厚膜电阻;; LCSC Part Name: 10kΩ ±1% 62.5mW 厚膜电阻; Supplier Part: C25744; Manufacturer: UNI-ROYAL(厚声); Supplier Footprint: 0402; JLCPCB Part Class: 基础库; Datasheet: https://atta.szlcsc.com/upload/public/pdf/source/20200306/C422600_1E6D84923E4A46A82E41ADD87F860B5C.pdf; Supplier: LCSC; Tolerance: ±1%; Power(Watts): 62.5mW; Overload Voltage (Max): 50V; Temperature Coefficient: ±100ppm/℃; Type: 厚膜电阻; Operating Temperature Range: -55℃~+155℃; Check: true
SW1 = TS-1185-B-B-B-A: 触点电流:50mA;额定电压(DC):12V;绝缘电阻:-;电路结构:单刀单掷;安装方式:立贴;带灯:无;作用力:160gf;机械寿命:10万次;带支架:否;; LCSC Part Name: 立贴 3*4*2.5mm 轻触开关; Supplier Part: C561521; Manufacturer: XKB Connectivity(中国星坤); Supplier Footprint: SMD; JLCPCB Part Class: 扩展库; Datasheet: https://atta.szlcsc.com/upload/public/pdf/source/20211011/C2F26DC0AE1820400F54DBF49644F5A1.pdf; Supplier: LCSC; Contact Current: 50mA; Voltage Rating (DC): 12V; Circuit: 单刀单掷; Mounting Style: 立贴; Actuator Style: 圆形按钮; Actuator/Cap Color: 黑色; With Lamp: 无; Operating Force: 160gf; Mechanical Life: 10万次; Operating Temperature: -30℃~+85℃; Switch Length: 3mm; Switch Width: 4mm; Switch Height: 2.5mm; Strike Gundam: 否; Check: true
U1 = STM32G474VET6: CPU内核:ARM Cortex-M4;CPU最大主频:170MHz;工作电压范围:1.71V~3.6V;内部振荡器:有;程序 FLASH容量:512K@x8bit;RAM总容量:128KB;EEPROM/数据 FLASH容量:-;GPIO端口数量:86;ADC(单元数/通道数/位数):1@x42ch/12bit;DAC(单元数/通道数/位数):1@x7ch/12bit;外设/功能/协议栈:DMA；PWM；看门狗;工作温度范围:-40℃~+85℃;; LCSC Part Name: ARM Cortex-M4 170MHz 闪存：512K@x8bit RAM：128KB; Supplier Part: C431632; Manufacturer: ST(意法半导体); Supplier Footprint: LQFP-100; JLCPCB Part Class: 扩展库; Datasheet: https://atta.szlcsc.com/upload/public/pdf/source/20200902/C431632_38212262685EE30B1989689374F08940.pdf; Supplier: LCSC; CPU Core: ARM Cortex-M4; Maximum Frequency: 170MHz; Supply Voltage Range: 1.71V~3.6V; Internal Oscillator: 有; Program FLASH Size: 512K@x8bit; RAM Size: 128KB; GPIO Ports Number: 86; ADC (Units/Channels/bits): 1@x42ch/12bit; DAC (Units/Channels/bits): 1@x7ch/12bit; Peripherals / Functions / Protocol Stacks: DMA；PWM；看门狗; Operating Temperature Range: -40℃~+85℃; Check: true
X1 = X50328MSB2GI: 频率:8MHz;负载电容:20pF;频率公差:±10ppm;; LCSC Part Name: 8MHz ±10ppm 20pF YSX530GA YSX530GA; Supplier Part: C115962; Manufacturer: YXC(扬兴晶振); Supplier Footprint: SMD5032-2P; JLCPCB Part Class: 基础库; Datasheet: https://atta.szlcsc.com/upload/public/pdf/source/20230220/0EBFFB9D6D8CE6A211407822BBB6C516.pdf; Supplier: LCSC; Crystal Type: 贴片无源晶振; Load Capacitance: 20pF; Frequency Tolerance: ±10ppm; Frequency Stability: ±50ppm; Operating Temperature: -40℃~+85℃; Check: true
C93 C98 = 100V100uF CD288: 容值:100uF;精度:±20%;额定电压:100V;; LCSC Part Name: 100uF ±20% 100V; Supplier Part: C2960285; Manufacturer: HRK(鸿瑞凯电子); Supplier Footprint: 插件,D10xL20mm; JLCPCB Part Class: 扩展库; Datasheet: https://atta.szlcsc.com/upload/public/pdf/source/20220224/2BF239947B8F146E9CE554E5F7610D0A.pdf; Supplier: LCSC; Tolerance: ±20%; Rated Voltage: 100V; Lead Spacing: 5mm; φD: 10mm; L: 20mm; Operating Temperature: -40℃~+105℃; Check: true
P3 = WJ500V-5.08-3P: 结构:1x3P;间距:5.08mm;颜色:绿色;安装方式:直插;额定电流:18A;额定电压:250V;排数:1;线规 - AWG:14~30;线规 - 平方毫米:2.5;每排PIN数:3;工作温度范围:-40℃~+105℃;; LCSC Part Name: 5.08mm 1x3P 排数:1 每排P数:3 直插; Supplier Part: C72334; Manufacturer: KANGNEX(康奈克斯电气); Supplier Footprint: 插件,P=5.08mm; JLCPCB Part Class: 扩展库; Datasheet: https://atta.szlcsc.com/upload/public/pdf/source/20191225/C72334_8A5EF831D67650233B6B1E3F2BC06274.pdf; Supplier: LCSC; Structure: 1x3P; Pitch: 5.08mm; Color: 绿色; Mounting Style: 直插; Current Rating (Max): 18A; Voltage Rating (Max): 250V; Number of Pins: 3P; Number of Rows: 1; Wire Gauge - AWG: 14~30; Wire Gauge - mm2: 2.5; Number of PINs Per Row: 3; Operating Temperature Range: -40℃~+105℃; Check: true
U29 = KF128-5.08-2P-AA: 结构:1x2P;间距:5.08mm;颜色:绿色;安装方式:直插;额定电流:24A;额定电压:250V;排数:1;线规 - AWG:12~22;线规 - 平方毫米:2.5;每排PIN数:2;工作温度范围:-40℃~+105℃;; LCSC Part Name: 5.08mm 1x2P 排数:1 每排P数:2 直插; Supplier Part: C474952; Manufacturer: KEFA(科发); Supplier Footprint: 插件,P=5.08mm; JLCPCB Part Class: 扩展库; Datasheet: https://atta.szlcsc.com/upload/public/pdf/source/20230317/DADFED05827EAD48C1D5B8C3D4CF88F4.pdf; Supplier: LCSC; Structure: 1x2P; Pitch: 5.08mm; Color: 绿色; Mounting Style: 直插; Current Rating (Max): 24A; Voltage Rating (Max): 250V; Number of Pins: 2P; Number of Rows: 1; Wire Gauge - AWG: 12~22; Wire Gauge - mm2: 2.5; Number of PINs Per Row: 2; Operating Temperature Range: -40℃~+105℃; Check: true

## Nets
+3.3V: C4.2 C5.2 C6.2 C7.2 C8.2 C9.2 C10.2 H1.1 L1.1 P3.3 R38.2 R78.2 R83.2 R88.2 U1.6(VBAT) U1.24(VDD) U1.49(VDD) U1.64(VDD) U1.75(VDD) U1.100(VDD)
+5V: C53.2 P3.2 U9.3(VCC)
+12V: C94.1 D7.2(A) D8.2(A) D9.2(A) P3.1 U28.7(VCC)
AGND: C1.2 C2.1 C3.2 C4.1 C5.1 C6.1 C7.1 C8.1 C9.1 C10.1 C11.1 C12.1 C52.1 C53.1 C94.2 H1.4 H2.3 H4.3 R1.2 R36.1 R79.1 R84.1 R89.1 R93.2 SW1.1 U1.23(VSS) U1.35(VSSA) U1.48(VSS) U1.63(VSS) U1.74(VSS) U1.99(VSS) U9.2(GND) U9.8(S) U28.8(COM)
PGND: C40.1 C41.1 C89.1 C93.2 C95.2 C96.2 C97.2 C98.2 R27.1 R28.1 R77.1 R81.1 R86.1 R91.1 R93.1 U29.2
VBUS: C52.2 R33.1 R36.2 U1.20(PA0)
CAN_RX: U1.72(PA11) U9.4(RXD)
CAN_TX: U1.73(PA12) U9.1(TXD)
CANH: H3.1 R37.2 U9.7(CANH)
CANL: H3.2 R37.1 U9.6(CANL)
DAC: P1.1 U1.26(PA4)
GH_A: R20.1 U28.19(HO1)
GH_B: R21.1 U28.16(HO2)
GH_C: R22.1 U28.13(HO3)
GL_A: R24.1 U28.11(LO1)
GL_B: R25.1 U28.10(LO2)
GL_C: R26.1 U28.9(LO3)
IA_P: C40.2 Q4.1(S) Q4.2(S) Q4.3(S) R27.2 R80.1
IB_P: C41.2 Q5.1(S) Q5.2(S) Q5.3(S) R28.2 R85.1
IC_P: C89.2 Q6.1(S) Q6.2(S) Q6.3(S) R77.2 R90.1
INH_A: U1.69(PA8) U28.1(HIN1)
INH_B: U1.70(PA9) U28.2(HIN2)
INH_C: U1.71(PA10) U28.3(HIN3)
INL_A: U1.52(PB13) U28.4(LIN1)
INL_B: U1.53(PB14) U28.5(LIN2)
INL_C: U1.54(PB15) U28.6(LIN3)
NRST: C2.2 SW1.2 U1.14(PG10-NRST)
OP1_VINM: R81.2 R82.2 U1.25(PA3)
OP1_VINP: R78.1 R79.2 R80.2 U1.21(PA1)
OP1_VOUT: R82.1 U1.22(PA2)
OP2_VINM: R86.2 R87.2 U1.27(PA5)
OP2_VINP: R83.1 R84.2 R85.2 U1.29(PA7)
OP2_VOUT: R87.1 U1.28(PA6)
OP3_VINM: R91.2 R92.2 U1.34(PB2)
OP3_VINP: R88.1 R89.2 R90.2 U1.32(PB0)
OP3_VOUT: R92.1 U1.33(PB1)
OSC_IN: C1.1 U1.12(PF0-OSC_IN) X1.2(OSC2)
OSC_OUT: C3.1 U1.13(PF1-OSC_OUT) X1.1(OSC1)
POWER: C93.1 C95.1 C96.1 C97.1 C98.1 Q1.5(D) Q1.6(D) Q1.7(D) Q1.8(D) Q2.5(D) Q2.6(D) Q2.7(D) Q2.8(D) Q3.5(D) Q3.6(D) Q3.7(D) Q3.8(D) R33.2 U29.1
RX: H2.2 U1.94(PB7)
RX3: H4.2 U1.46(PE15)
SH_A: C92.1 J1.3 Q1.1(S) Q1.2(S) Q1.3(S) Q4.5(D) Q4.6(D) Q4.7(D) Q4.8(D) U28.18(VS1)
SH_B: C91.1 J1.2 Q2.1(S) Q2.2(S) Q2.3(S) Q5.5(D) Q5.6(D) Q5.7(D) Q5.8(D) U28.15(VS2)
SH_C: C90.1 J1.1 Q3.1(S) Q3.2(S) Q3.3(S) Q6.5(D) Q6.6(D) Q6.7(D) Q6.8(D) U28.12(VS3)
SWCLK: H1.3 U1.77(PA14)
SWDIO: H1.2 U1.76(PA13)
TX: H2.1 U1.93(PB6)
TX3: H4.1 U1.47(PB10)
$1N2896: C11.2 C12.2 L1.2 U1.36(VREF+) U1.37(VDDA)
$1N3277: R1.1 U1.95(PB8-BOOT0)
$5N9514: Q1.4(G) R20.2
$5N9618: Q4.4(G) R24.2
$5N10412: Q2.4(G) R21.2
$5N10417: Q5.4(G) R25.2
$5N10865: Q3.4(G) R22.2
$5N10870: Q6.4(G) R26.2
$5N19775: R38.1 U9.5(VREF)
$5N68095: C90.2 D7.1(C) U28.14(VB3)
$5N68096: C91.2 D8.1(C) U28.17(VB2)
$5N68097: C92.2 D9.1(C) U28.20(VB1)

Not connected (* = marked no-connect by the designer): U1 1(PE2)* 2(PE3)* 3(PE4)* 4(PE5)* 5(PE6)* 7(PC13)* 8(PC14-OSC32_IN)* 9(PC15-OSC32_OUT)* 10(PF9)* 11(PF10)* 15(PC0)* 16(PC1)* 17(PC2)* 18(PC3)* 19(PF2)* 30(PC4)* 31(PC5)* 38(PE7)* 39(PE8)* 40(PE9)* 41(PE10)* 42(PE11)* 43(PE12)* 44(PE13)* 45(PE14)* 50(PB11)* 51(PB12)* 55(PD8)* 56(PD9)* 57(PD10)* 58(PD11)* 59(PD12)* 60(PD13)* 61(PD14)* 62(PD15)* 65(PC6)* 66(PC7)* 67(PC8)* 68(PC9)* 78(PA15)* 79(PC10)* 80(PC11)* 81(PC12)* 82(PD0)* 83(PD1)* 84(PD2)* 85(PD3)* 86(PD4)* 87(PD5)* 88(PD6)* 89(PD7)* 90(PB3)* 91(PB4)* 92(PB5)* 96(PB9)* 97(PE0)* 98(PE1)*

## Notes on the sheets
sheet 1
- 时钟电路（未连接 OSC32_OUT）
- 复位电路
  (不连接上拉电阻）
- 注意预留相应输出引脚
- 供电电路（部分）
- 在 PCB 设计过程中， 电容必须尽可能接近相应的引脚。
- SWD调试电路
- 在 PCB 设计中，SWDIO与SWCLK
  需长度相等并进行隔离。
- USART接头
- DAC接头
sheet 2
- 电源接口
- DC-DC 48V-12V
- 使用电源地GND。
  电源地GND与模拟地AGND之间使用单点连接。
- DC-DC 12V-5V
- LDO 5V-3.3V
sheet 3
- H桥模块
- 预驱动模块
- Resistor should connect to GND
  with very short trace to reduce the
  potential clock jitter due to noise
- CAN模块
